# EAGLE design ESP32_mini (EAGLE 9.5.2)
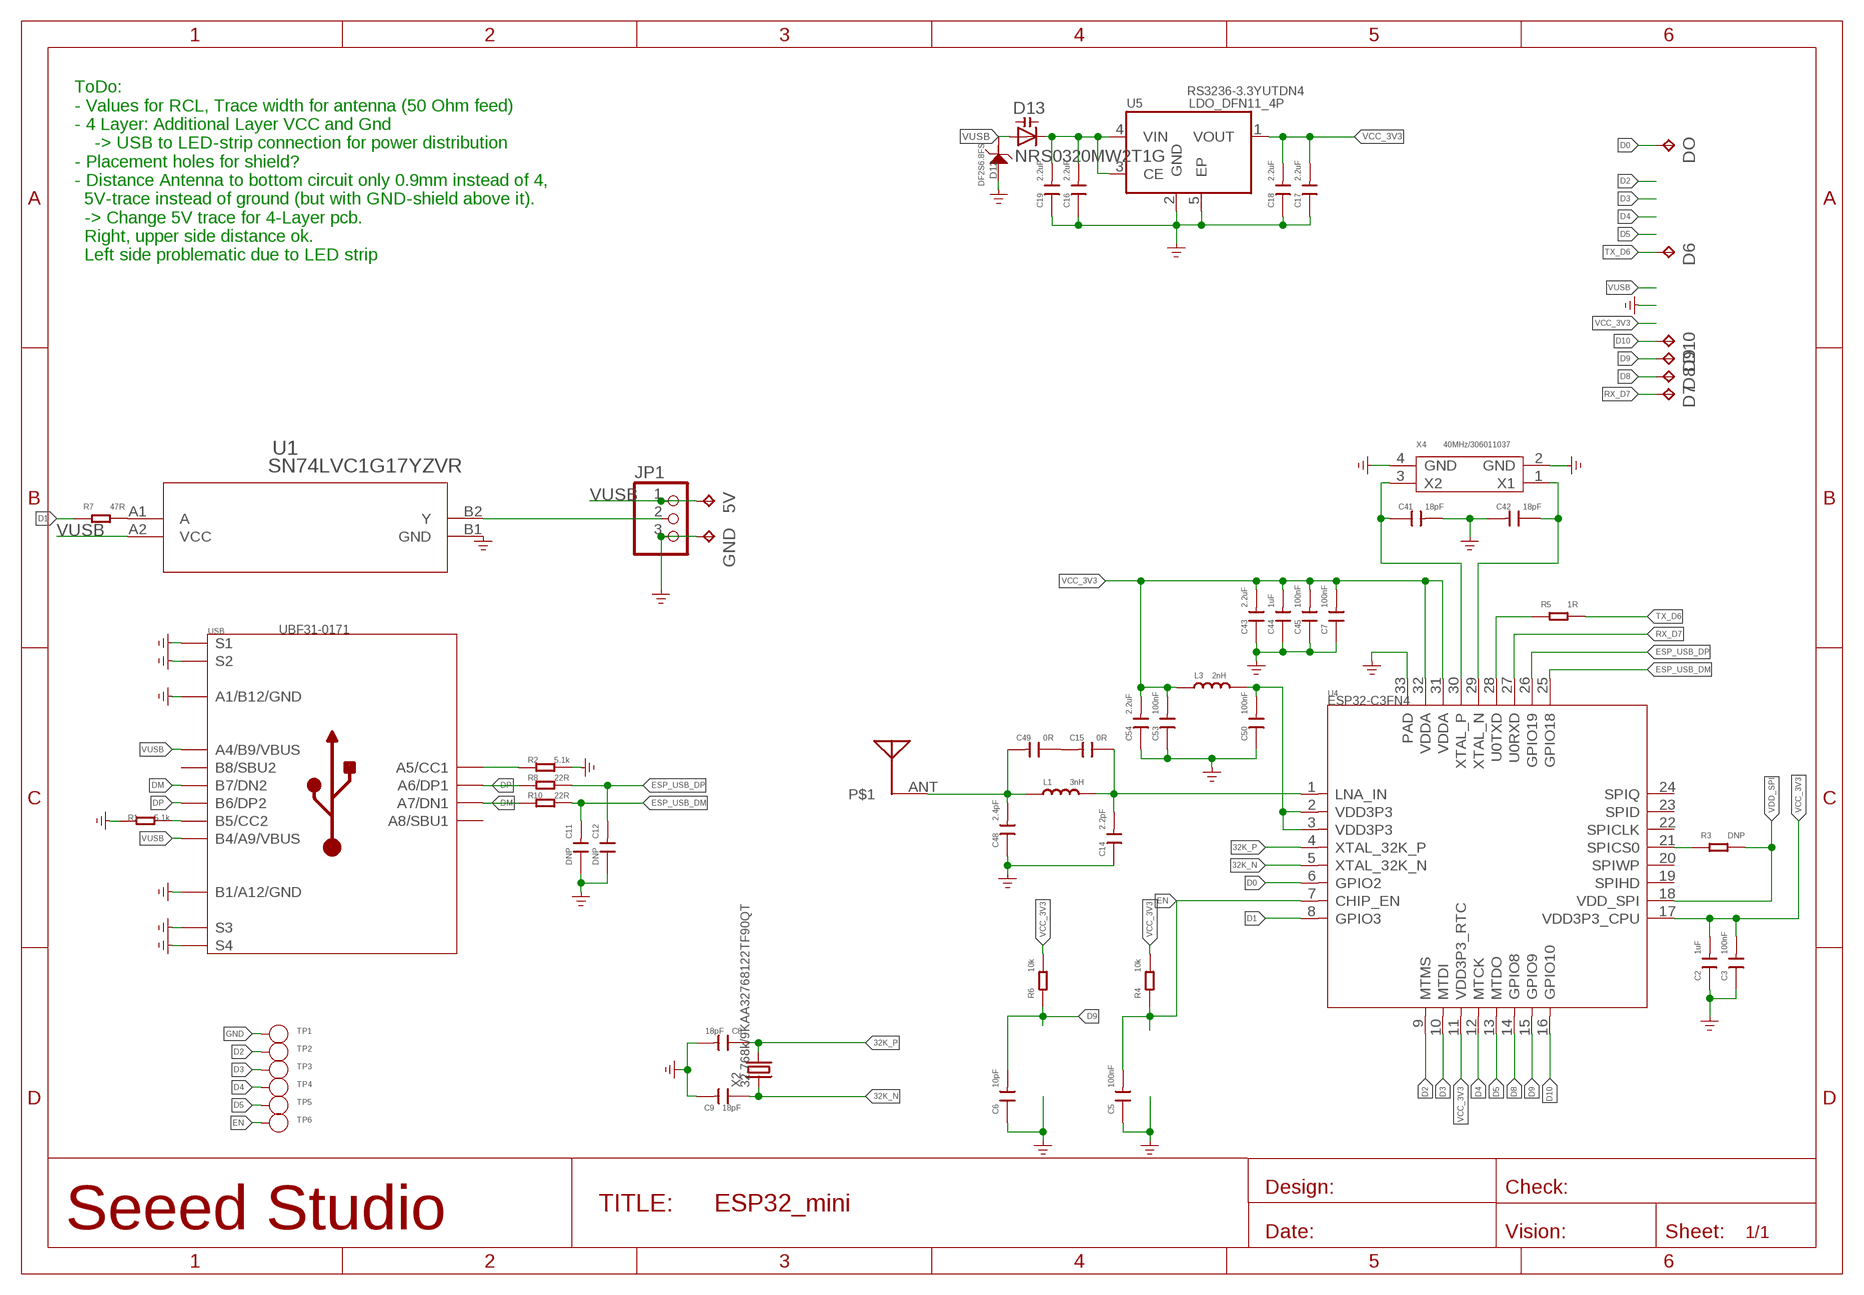
[diagram p0: schematic, sheet 1]

## Parts
5V  TPTP07R  [TP07R]
C2  1uF  CAP-0201  [C0201]
C3  100nF  CAP-0201  [C0201]
C5  100nF  CAP-0201  [C0201]
C6  10pF  CAP-0201  [C0201]
C7  100nF  CAP-0201  [C0201]
C8  18pF  CAP-0201  [C0201]
C9  18pF  CAP-0201  [C0201]
C11  DNP  CAP-0201  [C0201]
C12  DNP  CAP-0201  [C0201]
C14  2.2pF  CAP-0201  [C0201]
C15  0R  CAP-0201  [C0201]
C16  2.2uF  CAP-0201  [C0201]
C17  2.2uF  CAP-0201  [C0201]
C18  2.2uF  CAP-0201  [C0201]
C19  2.2uF  CAP-0201  [C0201]
C41  18pF  CAP-0201  [C0201]
C42  18pF  CAP-0201  [C0201]
C43  2.2uF  CAP-0201  [C0201]
C44  1uF  CAP-0201  [C0201]
C45  100nF  CAP-0201  [C0201]
C48  2.4pF  CAP-0201  [C0201]
C49  0R  CAP-0201  [C0201]
C50  100nF  CAP-0201  [C0201]
C53  100nF  CAP-0201  [C0201]
C54  2.2uF  CAP-0201  [C0201]
D6  TPTP07R  [TP07R]
D7  TPTP07R  [TP07R]
D8  TPTP07R  [TP07R]
D9  TPTP07R  [TP07R]
D10  TPTP07R  [TP07R]
D12  DF2S6.8FS  D-ESD-2P'DF2S6.8FS'  [SOD-923]
D13  NRS0320MW2T1G  DIODE_CAPACITANCE-SOD523  [SOD523]
DO  TPTP09R  [TP09R]
GND  TPTP07R  [TP07R]
JP1  PINHD-1X3  [1X03]
L1  3nH  INDUCTOR-0201  [L0201]
L3  2nH  INDUCTOR-0201  [L0201]
R1  5.1k  RES-0201  [R0201]
R2  5.1k  RES-0201  [R0201]
R3  DNP  RES-0201  [R0201]
R4  10k  RES-0201  [R0201]
R5  1R  RES-0201  [R0201]
R6  10k  RES-0201  [R0201]
R7  47R  RES-0201  [R0201]
R8  22R  RES-0201  [R0201]
R10  22R  RES-0201  [R0201]
TP1  DNP  TEST-POINT-35  [TP_3535]
TP2  DNP  TEST-POINT-35  [TP_3535]
TP3  DNP  TEST-POINT-35  [TP_3535]
TP4  DNP  TEST-POINT-35  [TP_3535]
TP5  DNP  TEST-POINT-35  [TP_3535]
TP6  DNP  TEST-POINT-35  [TP_3535]
U1  SN74LVC1G17YZVR  [YZV4]
U4  ESP32-C3FN4  MCU-ESP32-C3  [QFN32G-0.5-5X5MM]
U5  LDO_DFN11_4P  [LDO_DFN1*1_4P]
U$1  KH5220-A36KH5220-A36  [KH5220-A36]
USB  UBF31-0171  USB2.0-TYPE-C  [USB2.0-TYPE-C]
X2  32.768k/9KAA32768122TF90QT  CRYSTAL-2P-1610  [X2-SMD-1.6X1.0X0.5MM]
X4  40MHz/306011037  CRYSTAL-4P-2016  [X4-SMD-2.0X1.6X0.5MM]

## Nets
32K_N: C9.1 U4.5(XTAL_32K_N) X2.1
32K_P: C8.1 U4.4(XTAL_32K_P) X2.2
D0: DO.TP U4.6(GPIO2)
D1: R7.2 U4.8(GPIO3)
D2: TP2.T U4.9(MTMS)
D3: TP3.T U4.10(MTDI)
D4: TP4.T U4.12(MTCK)
D5: TP5.T U4.13(MTDO)
D8: D8.TP U4.14(GPIO8)
D9: C6.2 D9.TP R6.1 U4.15(GPIO9)
D10: D10.TP U4.16(GPIO10)
DM: R10.1 USB.A7(A7/DN1) USB.B7(B7/DN2)
DP: R8.1 USB.A6(A6/DP1) USB.B6(B6/DP2)
EN: C5.2 R4.1 TP6.T U4.7(CHIP_EN)
ESP_USB_DM: C11.2 R10.2 U4.25(GPIO18)
ESP_USB_DP: C12.2 R8.2 U4.26(GPIO19)
GND: C2.1 C3.1 C5.1 C6.1 C7.1 C8.2 C9.2 C11.1 C12.1 C14.1 C16.1 C17.1 C18.1 C19.1 C41.2 C42.2 C43.1 C44.1 C45.1 C48.1 C50.1 C53.1 C54.1 D12.2 GND.TP JP1.3 R1.1 R2.2 TP1.T U1.B1(GND) U4.33(PAD) U5.2(GND) U5.5(EP) USB.A1_B12(A1/B12/GND) USB.B1_A12(B1/A12/GND) USB.S1 USB.S2 USB.S3 USB.S4 USB.S5(S1) USB.S6(S2) X4.2(GND) X4.4(GND) ; supply symbol labelled GND_POWER
N$1: R2.1 USB.A5(A5/CC1)
N$2: R1.2 USB.B5(B5/CC2)
N$3: R3.1 U4.21(SPICS0)
N$4: JP1.2 U1.B2(Y)
N$6: C15.2 C49.1
N$7: R7.1 U1.A1(A)
N$22: C14.2 C15.1 L1.2 U4.1(LNA_IN)
N$26: C41.1 U4.30(XTAL_P) X4.3(X2)
N$27: C42.1 U4.29(XTAL_N) X4.1(X1)
N$28: C48.2 C49.2 L1.1 U$1.ANT
N$29: R5.2 U4.28(U0TXD)
N$34: C50.2 L3.2 U4.2(VDD3P3) U4.3(VDD3P3)
RX_D7: D7.TP U4.27(U0RXD)
TX_D6: D6.TP R5.1
VCC_3V3: C2.2 C3.2 C7.2 C17.2 C18.2 C43.2 C44.2 C45.2 C53.2 C54.2 L3.1 R4.2 R6.2 U4.11(VDD3P3_RTC) U4.17(VDD3P3_CPU) U4.31(VDDA) U4.32(VDDA) U5.1(VOUT)
VDD_SPI: R3.2 U4.18(VDD_SPI)
VIN: C16.2 C19.2 D13.C U5.3(CE) U5.4(VIN)
VUSB: 5V.TP D12.1 D13.A JP1.1 U1.A2(VCC) USB.A4_B9(A4/B9/VBUS) USB.B4_A9(B4/A9/VBUS)
Unconnected: U4.19(SPIHD) U4.20(SPIWP) U4.22(SPICLK) U4.23(SPID) U4.24(SPIQ) USB.A8(A8/SBU1) USB.B8(B8/SBU2)

## Notes on the sheet
- RS3236-3.3YUTDN4
- ToDo:
  - Values for RCL, Trace width for antenna (50 Ohm feed)
  - 4 Layer: Additional Layer VCC and Gnd 
      -> USB to LED-strip connection for power distribution
  - Placement holes for shield?
  - Distance Antenna to bottom circuit only 0.9mm instead of 4,
    5V-trace instead of ground (but with GND-shield above it). 
    -> Change 5V trace for 4-Layer pcb. 
    Right, upper side distance ok.
    Left side problematic due to LED strip

## Library data of the parts
5V D6-D10 DO GND = testpad:TP: Test pad
C2 C3 C5-C9 C11 C12 C14-C19 C41-C45 C48-C50 C53 C54 = Discrete-new:CAP: Ceramic Capacitors
D12 = Discrete-new:D-ESD-2P: SOD-923:304060009;SOD-123:304060001
D13 = XIAO RP2040 PRD v1.0:DIODE_CAPACITANCE-: Capacity DIODE
JP1 = Connector:PINHD-1X3: PIN HEADER; CATEGORY: CONNECTOR; SUB-CATEGORY: PIN-HEADER
L1 L3 = Discrete-new:INDUCTOR
R1-R8 R10 = Discrete-new:RES
TP1-TP6 = Discrete-new:TEST-POINT
U1 = thar:SN74LVC1G17YZVR; COPYRIGHT: Copyright (C) 2024 Ultra Librarian. All rights reserved.; MANUFACTURER_PART_NUMBER: SN74LVC1G17YZVR; MFR_NAME: Texas Instruments
U4 = IC-new:MCU-ESP32-C3
U5 = LDO_DFN1X1_4P:LDO_DFN1*1_4P
U$1 = thar:KH5220-A36
USB = USB C:USB2.0-TYPE-C
X2 = Discrete-new:CRYSTAL-2P
X4 = Discrete-new:CRYSTAL-4P

## Net classes
0 default: width 0.089 mm, drill 0.2 mm, clearance 0.102 mm

## Board
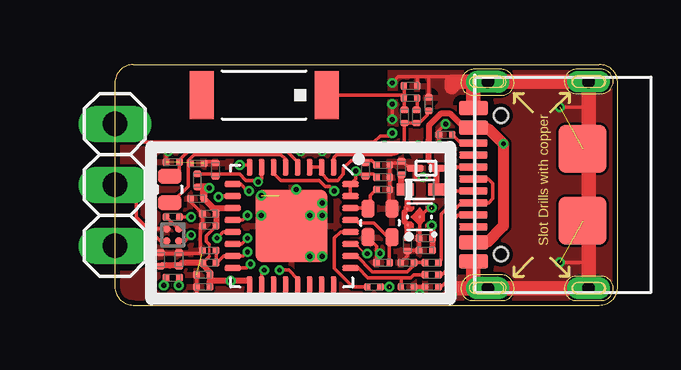
[diagram p1: board, top side]
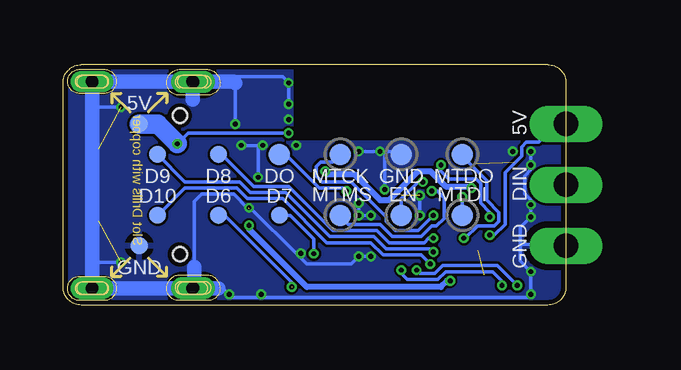
[diagram p2: board, bottom side, seen from below]

Size 20.95 x 10.03 mm. Coordinates in mm from the lower left corner, seen from the top.
Outline: 20.95,0.76 20.95,9.27 arc90 20.19,10.03 0.76,10.03 arc90 0,9.27 0,0.76 arc90 0.76,0 20.19,0 arc90 20.95,0.76
Copper layers (1*16): Top 0.035mm / dielectric 0.2mm / Bottom 0.035mm
Design rules "Seeed": minimum track width 1mil, minimum drill 0.2mm, track to track 4mil, track to pad 4mil, pad to pad 4mil, via to via 4mil, smd to smd 0mil, copper to edge 0.2mm, drill to drill 12mil, minimum pad ring 4mil, minimum via ring 4mil, stop-mask expansion 4mil, vias tented up to drill 25mil, thermal gap 10mil

### Footprints (pad centres in the part's own frame; a part is rotated, then mirrored left to right if it is on the bottom)
TP07R = smd 0.7 x 0.7: TP 0,0
C0201 = smd 0.279 x 0.318: 1 -0.279,0; 2 0.279,0
SOD-923 = smd 0.7 x 0.3: 1 -0.45,0; 2 0.45,0
SOD523 = smd 0.7 x 0.5: A 0.7,0; C -0.6,0
TP09R = smd 0.9 x 0.9: TP 0,0
1X03 = drill 1.016 long: 1 -2.54,0; 2 0,0; 3 2.54,0
L0201 = smd 0.279 x 0.318: 1 -0.279,0; 2 0.279,0
R0201 = smd 0.279 x 0.318: 1 -0.279,0; 2 0.279,0
TP_3535 = smd 0.889 x 0.889: T 0,0
YZV4 = smd 0.305 x 0.305: A1 -0.25,0.25; A2 0.25,0.25; B1 -0.25,-0.25; B2 0.25,-0.25
QFN32G-0.5-5X5MM = smd 0.25 x 0.7: 1 -1.75,-2.45; 2 -1.25,-2.45; 3 -0.75,-2.45; 4 -0.25,-2.45; 5 0.25,-2.45; 6 0.75,-2.45; 7 1.25,-2.45; 8 1.75,-2.45; 17 1.75,2.45; 18 1.25,2.45; 19 0.75,2.45; 20 0.25,2.45; 21 -0.25,2.45; 22 -0.75,2.45; 23 -1.25,2.45; 24 -1.75,2.45 | smd 0.7 x 0.25: 9 2.45,-1.75; 10 2.45,-1.25; 11 2.45,-0.75; 12 2.45,-0.25; 13 2.45,0.25; 14 2.45,0.75; 15 2.45,1.25; 16 2.45,1.75; 25 -2.45,1.75; 26 -2.45,1.25; 27 -2.45,0.75; 28 -2.45,0.25; 29 -2.45,-0.25; 30 -2.45,-0.75; 31 -2.45,-1.25; 32 -2.45,-1.75 | smd 3 x 3: 33 0,0
LDO_DFN1*1_4P = smd 0.1 x 0.1: 1 -0.33,-0.5; 2 0.33,-0.5; 3 0.33,0.51; 4 -0.33,0.5; 5 0,0
KH5220-A36 = smd 1 x 2: ANT 2.6,0; NC -2.6,0
USB2.0-TYPE-C = smd 1.2 x 0.6: A1_B12 0.05,3.2; A4_B9 0.05,2.4; B1_A12 0.05,-3.2; B4_A9 0.05,-2.4 | smd 1.2 x 0.3: A5 0.05,1.25; A6 0.05,0.25; A7 0.05,-0.25; A8 0.05,-1.25; B5 0.05,-1.75; B6 0.05,-0.75; B7 0.05,0.75; B8 0.05,1.75 | drill 0.508 pad 0.889 long: S1 -4.763,4.318; S2 -4.763,-4.318; S3 -0.572,4.318; S4 -0.572,-4.318 | smd 2 x 2: S5 -4.5,1.5; S6 -4.5,-1.5 | hole 0.6: -1.1,-2.89; -1.1,2.89
USB-C_USB2.0-TYPE-C = smd 1.2 x 0.6: A1_B12 0.05,3.2; A4_B9 0.05,2.4; B1_A12 0.05,-3.2; B4_A9 0.05,-2.4 | smd 1.2 x 0.3: A5 0.05,1.25; A6 0.05,0.25; A7 0.05,-0.25; A8 0.05,-1.25; B5 0.05,-1.75; B6 0.05,-0.75; B7 0.05,0.75; B8 0.05,1.75 | drill 0.508 pad 0.889 long: S1 -4.75,4.3; S2 -4.75,-4.3 | drill 0.508 pad 0.914 long: S3 -0.55,4.3; S4 -0.55,-4.3 | smd 2 x 2: S5 -4.5,1.5; S6 -4.5,-1.5 | hole 0.6: -1.1,-2.89; -1.1,2.89
X2-SMD-1.6X1.0X0.5MM = smd 0.6 x 1: 1 -0.55,0; 2 0.55,0
X4-SMD-2.0X1.6X0.5MM = smd 0.75 x 0.55: 1 -0.6,-0.5; 2 0.6,-0.5; 3 0.6,0.5; 4 -0.6,0.5

### Placement (x,y rotation side)
5V  17.78,7.56 0 bottom
C2  3.68,0.76 0 top
C3  11.18,5.33 180 top
C5  4.19,5.65 270 top
C6  3.94,2.29 0 top
C7  3.68,1.27 0 top
C8  2.41,5.97 180 top
C9  3.43,5.91 0 top
C11  12.19,0.76 180 top
C12  12.19,1.78 0 top
C14  13.08,8.38 270 top
C15  12.57,7.87 90 top
C16  12.19,2.54 90 top
C17  12.95,2.29 0 top
C18  12.95,2.79 0 top
C19  11.94,5.72 270 top
C41  11.18,4.83 0 top
C42  11.18,1.78 180 top
C43  2.67,1.91 270 top
C44  1.91,1.91 270 top
C45  3.43,4.45 0 top
C48  12.32,9.14 180 top
C49  12.32,8.64 180 top
C50  11.18,5.84 180 top
C53  3.94,3.3 0 top
C54  3.94,3.81 0 top
D6  14.48,3.75 180 bottom
D7  11.94,3.75 180 bottom
D8  14.48,6.29 180 bottom
D9  17.02,6.29 180 bottom
D10  17.02,3.75 180 bottom
D12  12.97,5.72 180 top
D13  12.7,4.83 0 top
DO  11.94,6.29 180 bottom
GND  17.78,2.48 0 bottom
JP1  0,5.02 270 top
L1  12.06,7.87 270 top
L3  10.44,5.65 90 top
R1  13.78,7.11 0 top
R2  13.21,0.76 180 top
R3  2.41,1.14 180 top
R4  3.43,5.21 270 top
R5  10.8,0.76 180 top
R6  3.94,1.78 180 top
R7  2.41,3.68 0 top
R8  13.21,1.78 180 top
R10  13.21,1.27 180 top
TP1  6.86,6.29 270 bottom
TP2  9.4,3.75 270 bottom
TP3  4.32,3.75 270 bottom
TP4  9.4,6.29 270 bottom
TP5  4.32,6.29 270 bottom
TP6  6.86,3.75 270 bottom
U1  2.41,2.92 270 top
U4  7.37,3.3 180 top
U5  12.7,3.68 90 top
U$1  6.22,8.76 0 top
USB  14.99,5.02 180 top
USB1  [USB-C_USB2.0-TYPE-C]  14.99,5.02 180 top
X2  2.29,4.83 90 top
X4  11.05,3.43 90 top

### Tracks (layer width: path | path; a pad name or v marks a point on that pad's centre or on a via)
32K_N
  Top 0.152: U4.5 7.12,6.09 6.92,6.29 3.3,6.29 3.05,6.03 3.11,5.97 3.05,5.97 | C9.1 3.05,6.01 3.05,5.97 | X2.1 2.37,4.28 3.05,4.95 3.05,5.97
32K_P
  Top 0.152: U4.4 7.62,5.97 7.05,6.54 3.17,6.54 2.69,6.06 C8.1 2.69,5.4 2.67,5.38 X2.2
D0  (via drill 0.2)
  Top 0.152: v9.14,4.76 8.95,4.95 8.76,4.95 8.51,5.21 6.91,5.21 6.62,5.5 U4.6
  Bottom 0.152: v9.14,4.76 9.14,4.83 9.21,4.89 10.29,4.89 11.68,6.29 DO.TP
D1  (via drill 0.2)
  Top 0.152: v5.21,5.84 5.65,5.84 5.62,5.81 U4.8 | v3.17,3.68 R7.2
  Bottom 0.152: v5.21,5.84 5.21,5.59 4.89,5.27 3.75,5.27 3.56,5.08 3.56,4.25 3.17,3.87 v3.17,3.68
D2  (via drill 0.2)
  Top 0.152: U4.9 5.23,5.05 5.53,4.76 v5.59,4.76
  Bottom 0.152: TP2.T 9.4,3.68 9.08,3.37 7.75,3.37 7.24,2.86 6.03,2.86 5.59,3.3 5.4,3.3 5.08,3.62 5.08,4.48 5.37,4.76 v5.59,4.76
D3  (via drill 0.2)
  Top 0.152: U4.10 4.36,4.55 v4.32,4.51
  Bottom 0.152: v4.32,4.51 TP3.T
D4  (via drill 0.2)
  Top 0.152: U4.12 5.33,3.55 v5.53,3.75
  Bottom 0.152: v5.53,3.75 6.16,3.11 7.11,3.11 7.49,3.49 7.49,3.68 8.95,5.14 10.16,5.14 10.41,5.4 10.41,5.78 10.22,5.97 9.72,5.97 TP4.T
D5  (via drill 0.2)
  Top 0.152: U4.13 4.51,3.05 v4.26,2.79
  Bottom 0.152: TP5.T 4.32,6.22 3.3,5.21 3.3,4.38 2.79,3.87 2.79,3.49 2.98,3.3 3.68,3.3 4.19,2.79 v4.26,2.79
D8  (via drill 0.2)
  Top 0.152: v5.53,2.79 5.28,2.55 U4.14
  Bottom 0.152: D8.TP 14.35,6.29 13.02,4.95 11.56,4.95 9.72,3.11 7.87,3.11 7.37,2.6 5.91,2.6 5.72,2.79 v5.53,2.79
D9  (via drill 0.2)
  Top 0.152: C6.2 R6.1 4.26,1.78 4.53,2.05 U4.15 5.35,2.05 v5.53,2.22
  Bottom 0.152: D9.TP 15.88,5.14 13.59,5.14 13.14,4.7 11.68,4.7 9.84,2.86 8,2.86 7.49,2.35 5.65,2.35 v5.53,2.22
D10  (via drill 0.2)
  Top 0.152: v5.65,1.71 5.49,1.55 U4.16
  Bottom 0.152: D10.TP 15.88,4.89 13.72,4.89 13.27,4.45 11.81,4.45 9.97,2.6 8.13,2.6 7.62,2.1 6.03,2.1 v5.65,1.71
DM
  Top 0.152: R10.1 13.62,1.27 13.84,1.5 13.84,3.68 14.43,4.27 USB.B7 15.57,4.27 15.75,4.45 15.75,5.08 15.56,5.27 USB.A7
DP
  Top 0.152: USB.A6 14.1,4.77 | R8.1 13.59,1.88 13.59,3.81 14.1,4.32 14.1,4.77 | USB.B6 14.28,5.77 14.1,5.59 14.1,4.77
EN  (via drill 0.2)
  Top 0.152: 6.03,5.21 6.12,5.29 U4.7 | 6.03,5.21 5.46,5.21 5.21,5.46 4.19,5.46 | 6.03,5.21 v5.97,5.14 | 4.19,5.46 4.28,5.37 C5.2 | R4.1 3.43,5.46 4.19,5.46
  Bottom 0.152: TP6.T 6.86,4.45 6.16,5.14 v5.97,5.14
ESP_USB_DM
  Top 0.152: R10.2 12.45,1.27 12.32,1.14 11.94,1.14 | 11.94,1.14 10.54,1.14 10.13,1.55 U4.25 | C11.2 11.94,0.79 11.94,1.14
ESP_USB_DP
  Top 0.152: R8.2 C12.2 12.47,1.68 12.19,1.4 10.73,1.4 10.07,2.05 U4.26
GND  (via drill 0.2)  (6 unrouted)
  Top 0.152: 12.7,2.79 U5.5 13.03,4.01 U5.2 | C18.1 C17.1 12.22,2.29 C16.1 12.19,2.06 C12.1 | C11.1 12.7,0.76 | 12.7,0.76 R2.2 | X4.2 11.43,4.15 11.43,4.8 C41.2 C3.1 C50.1 11.43,5.84 11.52,5.93 11.87,5.93 C19.1 11.98,5.99 12.26,5.72 D12.2 12.52,5.33 v12.83,5.33 | X4.4 10.92,2.46 10.92,2.16 | 10.92,2.16 10.92,1.8 C42.2 | C7.1 C2.1 3.4,0.32 3.35,0.32 | C45.1 3.15,4.32 C54.1 C53.1 3.56,3.2 3.56,2.39 C6.1 3.53,2.16 2.64,2.16 | 2.64,2.16 1.93,2.16 | 1.93,2.16 C44.1 | 2.64,2.16 C43.1 | C5.1 4.13,5.99 3.8,5.99 C9.2 | U1.B1 1.78,3.17 1.46,3.49 v1.46,3.68 v1.46,4.19 | 12.7,0.76 v12.7,0.45 12.7,0.32 | v11.05,2.16 10.92,2.16 | v13.53,6.67 13.5,6.69 R1.1 13.5,7.28 v13.78,7.56 | 1.46,2.16 1.93,2.16 | 19.75,1.78 v18.54,1.78 | 19.75,8.26 v18.54,8.26 | v2.22,6.41 2.13,6.41 | 2.13,6.41 v1.46,6.41 v1.46,5.84 | 12.7,0.32 1.59,0.32 v1.46,0.45 v1.46,1.4 1.46,2.16 | 14.29,0.7 v14.03,0.45 13.91,0.32 12.7,0.32 | 1.46,2.16 1.46,2.48 JP1.3 | C8.2 2.13,6.41 | USB.S4 15.37,9.53 13.08,9.53 | 13.08,9.53 12.6,9.53 | 12.6,9.53 11.81,9.53 v11.56,9.27 | C48.1 12.6,9.53 | v11.56,8.38 v11.56,7.75 | C14.1 13.08,9.53 | U4.33 6.86,3.81 6.86,4.57 | U4.33 7.75,3.68 7.75,4.64 v7.56,4.83 8.13,4.25 v8.13,3.75 7.81,3.75 U4.33 | U4.33 v8.64,2.03
  Top 0.457: USB.S3 15.05,0.7 14.94,0.81
  Top 0.61: USB.A1_B12 14.94,0.81 | USB.B1_A12 14.94,9.32 14.92,9.33 14.22,9.33 14.05,9.11 14.05,9.33 USB.S4 USB.S2 19.75,8.26 19.75,1.78 USB.S1 USB.S3 14.29,0.7
  Bottom 0.152: 12.83,6.67 v13.53,6.67 | 19.75,1.78 v18.54,1.78 | 19.75,8.26 v18.54,8.26 | 1.91,2.54 1.91,1.84 v1.46,1.4 v1.46,0.45 1.59,0.32 12.7,0.32 | 1.91,2.54 1.91,3.24 v1.46,3.68 v1.46,4.19 1.46,4.38 1.71,4.64 1.71,5.4 1.46,5.65 v1.46,5.84 v1.46,6.41 | JP1.3 0.06,2.54 1.91,2.54 | TP1.T 6.98,6.41 7.56,6.41 | 7.56,6.41 v7.75,6.41 v8.64,6.41 | v11.56,8.38 v11.56,9.27 11.81,9.53 13.78,9.53 | 15.49,1.59 15.49,4.32 15.18,4.64 13.84,4.64 13.27,4.06 v13.21,4.06 13.14,4.06 11.18,2.1 11.11,2.1 v11.05,2.16 11.14,2.06 10.8,1.71 8.95,1.71 v8.64,2.03 v8.13,2.03 | 14.48,0.7 14.42,0.76 14.35,0.76 v14.03,0.45 13.91,0.32 12.7,0.32 | v13.78,7.56 13.78,9.27 13.78,9.53 | USB.S4 15.24,9.33 15.05,9.53 13.78,9.53 | v12.64,6.67 12.83,6.67 | 12.83,6.67 v12.83,5.33 | 12.7,0.32 12.67,0.35 12.7,0.38 v12.7,0.45 | v6.1,4.57 v6.1,3.75 | v8.13,3.75 v8.64,3.75 v8.64,4.25 | v7.56,4.83 7.56,6.41
  Bottom 0.457: USB.S2 19.75,8.26 19.75,1.78 USB.S1
  Bottom 0.61: USB.S4 13.84,9.33 13.78,9.27 | USB.S4 USB.S2 USB.S1 USB.S3 | USB.S3 15.49,0.76 15.49,1.59 | USB.S4 15.56,8.57 | USB.S3 14.48,0.7
  other vias: 11.24,6.67
  pour Bottom: 0,0 20.95,0 20.95,10.03 11.43,10.03 11.43,6.79 0,6.79
  pour Top: 0,0 20.95,0 20.95,10.03 11.43,10.03 11.43,6.79 0,6.79
N$1
  Top 0.152: USB.A5 14.31,3.77 14.1,3.56 14.1,1.27 13.59,0.76 R2.1
N$2
  Top 0.152: USB.B5 14.4,6.77 R1.2
N$3  (via drill 0.2)
  Top 0.152: U4.21 7.62,1.08 7.24,1.46 v6.86,1.46 | v2.67,0.83 2.67,1.12 R3.1
  Bottom 0.152: v6.86,1.46 6.86,1.33 6.6,1.08 5.33,1.08 5.02,1.4 3.05,1.4 2.67,1.02 v2.67,0.83
N$4
  Top 0.152: U1.B2 1.9,2.67 0.89,3.68 0.89,5.02 JP1.2
N$6
  Top 0.152: C49.1 12.6,8.18 C15.2
N$7
  Top 0.152: U1.A1 2.65,3.17 R7.1
N$22
  Top 0.152: C14.2 13.02,8.04 13.02,7.94 12.67,7.6 C15.1 L1.2 12.06,6.86 arc-90 11.49,6.29 9.34,6.29 arc90 9.12,6.07 U4.1
N$26
  Top 0.152: U4.30 10.53,4.05 X4.3 10.64,4.12 10.64,4.57 C41.1
N$27
  Top 0.152: U4.29 10.04,3.55 10.16,3.43 10.8,3.43 11.39,2.83 | 11.39,2.83 X4.1 | 11.39,2.83 11.43,2.79 11.43,1.8 C42.1
N$28
  Top 0.152: C48.2 12.06,9.12 12.06,8.76 | 12.06,8.66 L1.1 | C49.2 12.06,8.66 | U$1.ANT 12.06,8.76 | 12.06,8.76 12.06,8.66
N$29
  Top 0.152: U4.28 9.4,3.05 9.14,2.79 9.14,1.52 9.91,0.76 R5.2
N$34
  Top 0.152: 10.92,5.84 C50.2 10.71,6.03 10.44,6.03 10.44,6.01 | U4.3 U4.2 8.62,5.48 8.89,5.21 9.28,5.21 9.53,5.46 9.53,5.72 9.84,6.03 10.41,6.03 10.44,6.01 | L3.2 10.44,6.01
RX_D7  (via drill 0.2)
  Top 0.089: U4.27 10.02,2.55
  Top 0.102: 10.02,2.55 10.41,2.16
  Top 0.152: v10.51,2.15 10.41,2.15 10.41,2.16
  Bottom 0.152: D7.TP 11.49,3.75 10.51,2.77 v10.51,2.15
TX_D6  (via drill 0.2)  (1 unrouted)
  Top 0.152: v11.43,0.76 R5.1
  Bottom 0.152: D6.TP 14.35,3.87 11.43,0.95 v11.43,0.76 11.43,0.75
VCC_3V3  (via drill 0.2)
  Top 0.089: C17.2 13.21,2.26
  Top 0.102: 3.94,2.54 3.94,2.03
  Top 0.152: U4.31 U4.32 10.03,5.27 v10.03,5.59 10.03,5.46 10.35,5.46 | C3.2 10.77,5.46 10.35,5.46 | U4.17 5.62,0.98 5.58,1.02 | C7.2 3.96,1.37 | L3.1 10.35,5.46 | v13.21,3.32 13.23,3.32 | R6.2 3.68,1.78 3.94,2.03 | C53.2 3.81,2.9 3.81,2.67 3.94,2.54 | v4.83,1.02 4.72,1.02
  Top 0.254: C17.2 C18.2 13.23,3.32 U5.1 | 5.58,1.02 v4.83,1.02 3.96,1.02 | 3.96,1.37 3.68,1.65 3.68,1.75 R6.2 | C53.2 C54.2 4.22,3.91 4.08,4.05 4.1,4.05 | C44.2 1.93,1.65 2.28,1.65 2.29,1.65 2.64,1.65 C43.2 2.82,1.78 R6.2 | C7.2 3.96,1.02 | C2.2 3.96,1.02 | R6.2 | 4.1,4.05 U4.11 | 4.1,4.05 C45.2
  Top 0.305: C45.2 3.71,4.93 R4.2 3.9,4.93 v3.94,4.89
  Bottom 0.254: v4.83,1.02 4.95,1.02 5.21,0.76 10.8,0.76 13.21,3.18 v13.21,3.32 | v10.03,5.59 9.91,5.46 8.83,5.46 7.75,4.38 7.37,4.38 6.16,5.59 5.65,5.59 5.02,4.95 4,4.95 v3.94,4.89
VDD_SPI  (via drill 0.2)
  Top 0.152: U4.18 6.12,1.35 v6.22,1.46 | R3.2 2.13,0.93 v2.03,0.83
  Bottom 0.152: v6.22,1.46 6.1,1.33 5.46,1.33 5.14,1.65 2.86,1.65 v2.03,0.83
VIN
  Top 0.152: U5.4 12.06,3.49 | 12.06,3.89 U5.3 | 12.19,4.7 12.06,4.83 D13.C 12.04,4.83 11.94,4.93 | C16.2
  Top 0.254: 12.06,3.89 12.06,3.49 | 12.19,4.7 U5.3 | C16.2 U5.4 | 11.94,4.93 C19.2
VUSB  (via drill 0.2)
  Top 0.152: 13.46,4.83 D13.A | D12.1 13.4,5.72 | 14.99,7.37 USB.B4_A9 15.51,7.42 v16.19,6.73 | U1.A2 2.92,2.67 v3.17,2.92 | JP1.1 0.38,7.56 1.14,6.79 10.8,6.79 11.05,7.05 11.43,7.05 v11.56,7.18
  Top 0.254: D13.A 13.4,5.72 13.08,6.03 13.08,6.92 13.08,7.49 13.58,7.99 13.98,7.99 14.56,7.42 USB.B4_A9
  Top 0.457: 14.99,7.37 15.56,7.37 v16.19,6.73 16.19,3.3 15.51,2.62 USB.A4_B9
  Bottom 0.152: v3.17,2.92 2.98,2.92 2.54,3.37 2.54,5.53 1.84,6.22 1.84,6.6 1.65,6.79 1.14,6.79 0.38,7.56 JP1.1 | v16.19,6.73 15.75,7.18 v11.56,7.18
  Bottom 0.813: v16.19,6.73 17.02,7.56 5V.TP

### Text on the board
bNames: 5V | DIN | MTDO | GND | MTCK | MTDI | EN | MTMS | GND